# Altium schematic sheet OSP_Carrier_V7_Release_USB.SchDoc: OSP Full Carrier Board
size B; DrawnBy: LP; Revision: 1; SheetNumber: 4; SheetTotal: 7
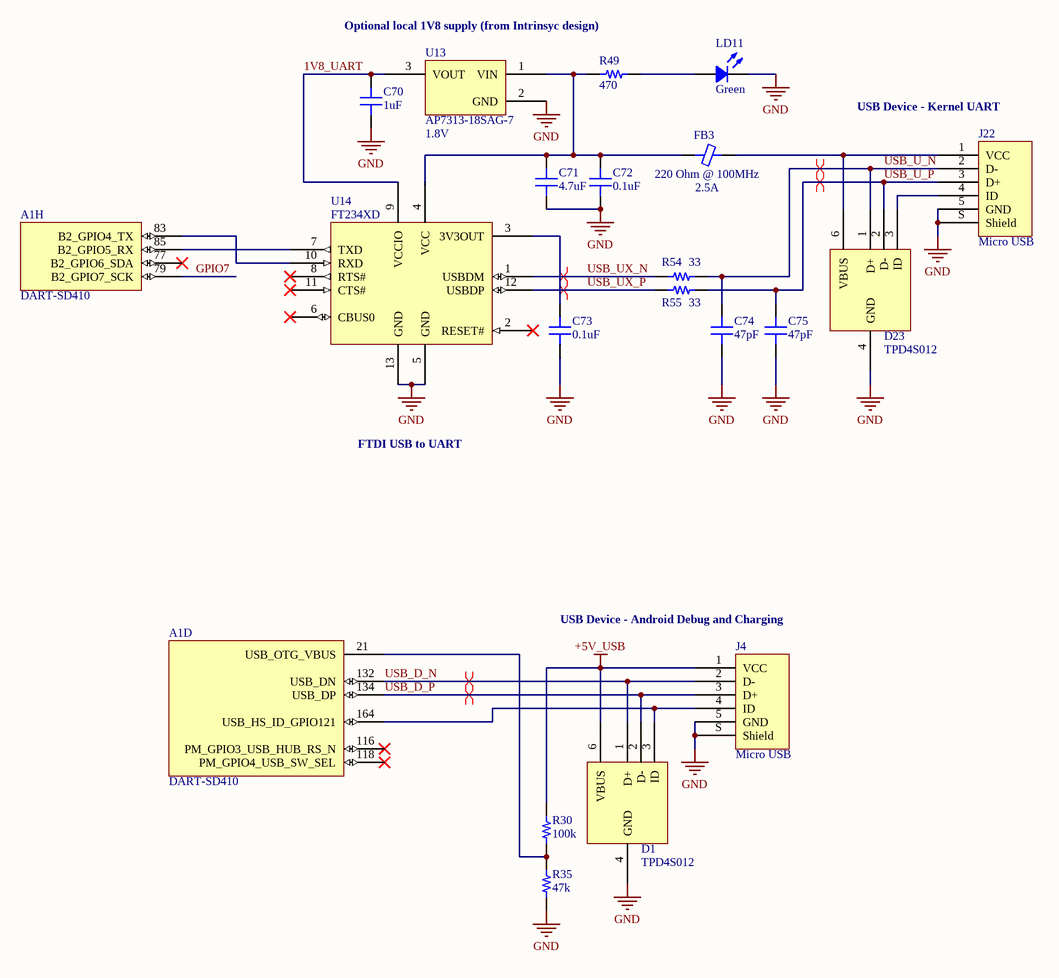
[diagram p0: OSP_Carrier_V7_Release_USB.SchDoc]

## Parts
A1  DART-SD410  [DART-SD410]  (parts D,H of 15)
C70  1uF  [CAP 0603/1608]
C71  4.7uF  [CAP 0402/1005]
C72  0.1uF  [CAP 0402/1005]
C73  0.1uF  [CAP 0402/1005]
C74  47pF  [CAP 0402/1005]
C75  47pF  [CAP 0402/1005]
D1  TPD4S012  [TI_SON6]
D23  TPD4S012  [TI_SON6]
FB3  220 Ohm @ 100MHz  Current Rating: 2.5A  [FER 0603/1608]
J4  Micro USB  [FCI USB 10118193-0001LF]
J22  Micro USB  [FCI USB 10118193-0001LF]
LD11  Green  [LED 0603/1608 GREEN]
R30  100k  [RES 0402/1005]
R35  47k  [RES 0402/1005]
R49  470  [RES 0402/1005]
R54  33  [RES 0402/1005]
R55  33  [RES 0402/1005]
U13  AP7313-18SAG-7  Voltage - Output: 1.8V  [DIODES SOT-23-3]
U14  FT234XD  [FTDI_DFN12]

## Nets
+5V_USB: D1.6(VBUS) J4.1(VCC) R30.2
GND: C70.1 C71.1 C72.1 C73.1 C74.1 C75.1 D1.4(GND) D23.4(GND) J4.5(GND) J4.S(Shield) J22.5(GND) J22.S(Shield) LD11.2 R35.1 U13.2(GND) U14.5(GND) U14.13(GND)
1V8_UART: C70.2 U13.3(VOUT) U14.9(VCCIO)
GPIO7: A1.79(B2_GPIO7_SCK)
USB_D_N: A1.132(USB_DN) D1.1(D+) J4.2(D-)
USB_D_P: A1.134(USB_DP) D1.2(D-) J4.3(D+)
USB_U_N: C74.2 D23.1(D+) J22.2(D-) R54.2
USB_U_P: C75.2 D23.2(D-) J22.3(D+) R55.2
USB_UX_N: R54.1 U14.1(USBDM)
USB_UX_P: R55.1 U14.12(USBDP)
NetA1_21: A1.21(USB_OTG_VBUS) R30.1 R35.2
NetA1_83: A1.83(B2_GPIO4_TX) U14.10(RXD)
NetA1_85: A1.85(B2_GPIO5_RX) U14.7(TXD)
NetA1_164: A1.164(USB_HS_ID_GPIO121) D1.3(ID) J4.4(ID)
NetC71_2: C71.2 C72.2 FB3.1 R49.1 U13.1(VIN) U14.4(VCC)
NetC73_2: C73.2 U14.3(3V3OUT)
NetD23_3: D23.3(ID) J22.4(ID)
NetD23_6: D23.6(VBUS) FB3.2 J22.1(VCC)
NetLD11_1: LD11.1 R49.2

Not connected (* = marked no-connect by the designer): A1 77(B2_GPIO6_SDA)* 116(PM_GPIO3_USB_HUB_RS_N)* 118(PM_GPIO4_USB_SW_SEL)*; U14 2(RESET#)* 6(CBUS0)* 8(RTS#)* 11(CTS#)*

## Layout directives
differential pair: USB_D_N, USB_D_P, USB_U_N, USB_U_P, USB_UX_N, USB_UX_P

## Notes on the sheet
- Optional local 1V8 supply (from Intrinsyc design)
- (near J22) USB Device - Kernel UART
- FTDI USB to UART
- (near J4) USB Device - Android Debug and Charging
- Title
- Size:
- Date:
- B
- Revision:
- Time:
- Drawn By:
- Approved:
- Sheet
- of
- LACI
- Atkinson Hall, 5202
- UC San Diego
- 9500 Gilman Drive #0436
- La Jolla, CA 92093-0436
- File:

## Library data of the parts
A1 = DART-SD410: Variscite DART-SD410 System on Module
C70 = C1608X7R1E105K080AB: CAP CER 1UF 25V X7R 0603; Manufacturer: TDK Corporation; TemperatureRange: -55C ~ 125C; Tolerance: 10%; Value: 1uF; Part Number: C1608X7R1E105K080AB; PartId: 4041; Supplier 1: Digi-Key; Supplier Part Number 1: 445-5956-1-ND; ComponentLink1Description: Datasheet; ComponentLink1URL: https://product.tdk.com/info/en/catalog/datasheets/mlcc_commercial_general_en.pdf; ComponentLink2Description: Digi-Key listing; ComponentLink2URL: http://digikey.com/product-detail/en/C1608X7R1E105K080AB/445-5956-1-ND/2443997; TemperatureCoefficient: X7R; Voltage: 25V; Price: 0.27; Type: -; Device Package: 0603 (1608 Metric)
C71 = C1005X5R1A475K050BC: CAP CER 4.7UF 10V X5R 0402; Manufacturer: TDK Corporation; TemperatureRange: -55C ~ 85C; Tolerance: 10%; Value: 4.7uF; Part Number: C1005X5R1A475K050BC; PartId: 12382; Supplier 1: Digi-Key; Supplier Part Number 1: 445-13820-2-ND; ComponentLink1Description: Datasheet; ComponentLink1URL: https://product.tdk.com/info/en/catalog/datasheets/mlcc_commercial_general_en.pdf; ComponentLink2Description: Digi-Key Listing; ComponentLink2URL: https://www.digikey.com/product-detail/en/tdk-corporation/C1005X5R1A475K050BC/445-13820-2-ND/3951056; TemperatureCoefficient: X5R; Voltage: 10V; Price: 0.096; Device Package: 0402 (1005 Metric)
C72 C73 = C1005X7R1H104K050BB: CAP CER 0.1UF 50V X7R 0402; Manufacturer: TDK Corporation; TemperatureRange: -55C ~ 125C; Tolerance: 10%; Value: 0.1uF; Part Number: C1005X7R1H104K050BB; PartId: 3860; Supplier 1: Digi-Key; Supplier Part Number 1: 445-5932-2-ND; ComponentLink1Description: Datasheet; ComponentLink1URL: https://product.tdk.com/info/en/catalog/datasheets/mlcc_commercial_general_en.pdf; ComponentLink2Description: Digi-Key listing; ComponentLink2URL: http://digikey.com/product-detail/en/C1005X7R1H104K050BB/445-5932-2-ND/2443410; TemperatureCoefficient: X7R; Voltage: 50V; Price: 0.0287; Type: -; Device Package: 0402 (1005 Metric)
C74 C75 = C1005C0G1H470G050BA: CAP CER 47PF 50V C0G 0402; Manufacturer: TDK Corporation; TemperatureRange: -55C ~ 125C; TemperatureCoefficient: C0G, NP0; Tolerance: 2%; Value: 47pF; Part Number: C1005C0G1H470G050BA; PartId: 3864; Supplier 1: Digi-Key; Supplier Part Number 1: 445-5364-2-ND; ComponentLink1Description: Datasheet; ComponentLink1URL: https://product.tdk.com/info/en/catalog/datasheets/mlcc_commercial_general_en.pdf; ComponentLink2Description: Digi-Key listing; ComponentLink2URL: http://digikey.com/product-detail/en/C1005C0G1H470G050BA/445-5364-2-ND/2269858; Voltage: 50V; Price: 0.1148; Type: -; Device Package: 0402 (1005 Metric)
D1 D23 = TI_TPD4S012: TI TPD4S012 USB ESD Protection
FB3 = CIS10P221NC: FERRITE CHIP 220 OHM 2500MA 0603; Manufacturer: Samsung Electro-Mechanics America, Inc.; Type: Differential Mode - Single; DC Resistance: 50 mOhm Max; Part Number: CIS10P221NC; PartId: 6665; Value: 220 Ohm @ 100MHz; Supplier 1: Digi-Key; Supplier Part Number 1: 1276-6350-2-ND; ComponentLink1Description: Datasheet; ComponentLink1URL: http://media.digikey.com/pdf/Data%20Sheets/Samsung%20PDFs/CIS10P.pdf; ComponentLink2Description: Digi-Key listing; ComponentLink2URL: http://digikey.com/product-detail/en/CIS10P221NC/1276-6350-2-ND/3973857; Price: 0.031; Device Package: 0603 (1608 Metric)
J4 J22 = 10118193-0001LF: CONN USB MICRO B RECPT SMT R/A; Part Number: 10118193-0001LF
LD11 = LTST-C191KGKT: LED GREEN CLEAR 0603 SMD; Manufacturer: Lite-On Inc.; Type: Surface Mount; Millicandela: 35mcd; Voltage Forward: 2V; Current (Test): 20mA; Viewing Angle: 130; Value: Green; Part Number: LTST-C191KGKT; PartId: 7051; Supplier 1: Digi-Key; Supplier Part Number 1: 160-1446-2-ND; ComponentLink1Description: Datasheet; ComponentLink1URL: http://optoelectronics.liteon.com/upload/download/DS22-2000-228/S_110_LTST-C191KGKT.pdf; ComponentLink2Description: Digi-Key Listing; ComponentLink2URL: http://www.digikey.ca/product-detail/en/LTST-C191KGKT/160-1446-2-ND/386835; Price: 0.0521; Device Package: 0603 (1608 Metric); Colour: Green; Lens Transparency: Clear
R30 = ERJ-2RKF1003X: RES SMD 100K OHM 1% 1/10W 0402; Manufacturer: Panasonic Electronic Components; TemperatureRange: -55C ~ 155C; TemperatureCoefficient: 100ppm/C; PowerRating: 0.1W, 1/10W; Value: 100k; Part Number: ERJ-2RKF1003X; PartId: 2; Supplier 1: Digi-Key; Supplier Part Number 1: P100KLTR-ND; ComponentLink1Description: Datasheet; ComponentLink1URL: http://industrial.panasonic.com/www-cgi/jvcr13pz.cgi?E+PZ+3+AOA0002+ERJ2RKF1003X+7+WW; ComponentLink2Description: Digikey listing; ComponentLink2URL: http://digikey.com/product-detail/en/ERJ-2RKF1003X/P100KLTR-ND/192081; Tolerance: 1%; Price: 0.0043; Type: Thick Film; Device Package: 0402 (1005 Metric)
R35 = ERJ-2RKF4702X: RES SMD 47K OHM 1% 1/10W 0402; Manufacturer: Panasonic Electronic Components; TemperatureRange: -55C ~ 155C; TemperatureCoefficient: 100ppm/C; PowerRating: 0.1W, 1/10W; Value: 47k; Part Number: ERJ-2RKF4702X; PartId: 22; Supplier 1: Digi-Key; Supplier Part Number 1: P47.0KLTR-ND; ComponentLink1Description: Datasheet; ComponentLink1URL: http://industrial.panasonic.com/www-cgi/jvcr13pz.cgi?E+PZ+3+AOA0002+ERJ2RKF4702X+7+WW; ComponentLink2Description: Digikey listing; ComponentLink2URL: http://digikey.com/product-detail/en/ERJ-2RKF4702X/P47.0KLTR-ND/1746233; Tolerance: 1%; Price: 0.0043; Type: Thick Film; Device Package: 0402 (1005 Metric)
R49 = ERJ-2RKF4700X: RES SMD 470 OHM 1% 1/10W 0402; Manufacturer: Panasonic Electronic Components; TemperatureRange: -55C ~ 155C; TemperatureCoefficient: 100ppm/C; PowerRating: 0.1W, 1/10W; Value: 470; Part Number: ERJ-2RKF4700X; PartId: 176; Supplier 1: Digi-Key; Supplier Part Number 1: P470LTR-ND; ComponentLink1Description: Datasheet; ComponentLink1URL: http://industrial.panasonic.com/www-cgi/jvcr13pz.cgi?E+PZ+3+AOA0002+ERJ2RKF4700X+7+WW; ComponentLink2Description: Digikey listing; ComponentLink2URL: http://digikey.com/product-detail/en/ERJ-2RKF4700X/P470LTR-ND/1746229; Tolerance: 1%; Price: 0.0043; Type: Thick Film; Device Package: 0402 (1005 Metric)
R54 R55 = ERJ-2RKF33R0X: RES SMD 33 OHM 1% 1/10W 0402; Manufacturer: Panasonic Electronic Components; TemperatureRange: -55C ~ 155C; TemperatureCoefficient: 100ppm/C; PowerRating: 0.1W, 1/10W; Value: 33; Part Number: ERJ-2RKF33R0X; PartId: 21; Supplier 1: Digi-Key; Supplier Part Number 1: P33.0LTR-ND; ComponentLink1Description: Datasheet; ComponentLink1URL: http://industrial.panasonic.com/www-cgi/jvcr13pz.cgi?E+PZ+3+AOA0002+ERJ2RKF33R0X+7+WW; ComponentLink2Description: Digikey listing; ComponentLink2URL: http://digikey.com/product-detail/en/ERJ-2RKF33R0X/P33.0LTR-ND/1746198; Tolerance: 1%; Price: 0.0043; Type: Thick Film; Device Package: 0402 (1005 Metric)
U13 = AP7313-18SAG-7: IC REG LDO 1.8V 0.15A SOT23-3; Manufacturer: Diodes Incorporated; Topology: Positive Fixed; Voltage - Input: 2 V ~ 6 V; Current - Limit (Min): 200mA; Part Number: AP7313-18SAG-7; PartId: 7912; Supplier 1: Digi-Key; Supplier Part Number 1: AP7313-18SAG-7DITR-ND; ComponentLink1Description: Datasheet; ComponentLink1URL: http://www.diodes.com/_files/datasheets/AP7313.pdf; ComponentLink2Description: Digi-Key Listing; ComponentLink2URL: http://www.digikey.ca/product-detail/en/AP7313-18SAG-7/AP7313-18SAG-7DITR-ND/2270804; Price: 0.1675; Device Package: TO-236-3, SC-59, SOT-23-3; Voltage Dropout: -; Operating Temperature: -40C ~ 85C
U14 = FTDI_FT234XD: FTDI FT234XD USB to UART